# EasyEDA Pro project OSC1.eprj, schematic 编码器
Create Date: 2024-10-08; Page Name: P1; Project Name: OSC; Schematic Name: Schematic2; Update Date: 2024-10-08; Company: 嘉立创EDA; Page Size: A4; Version: V1.0
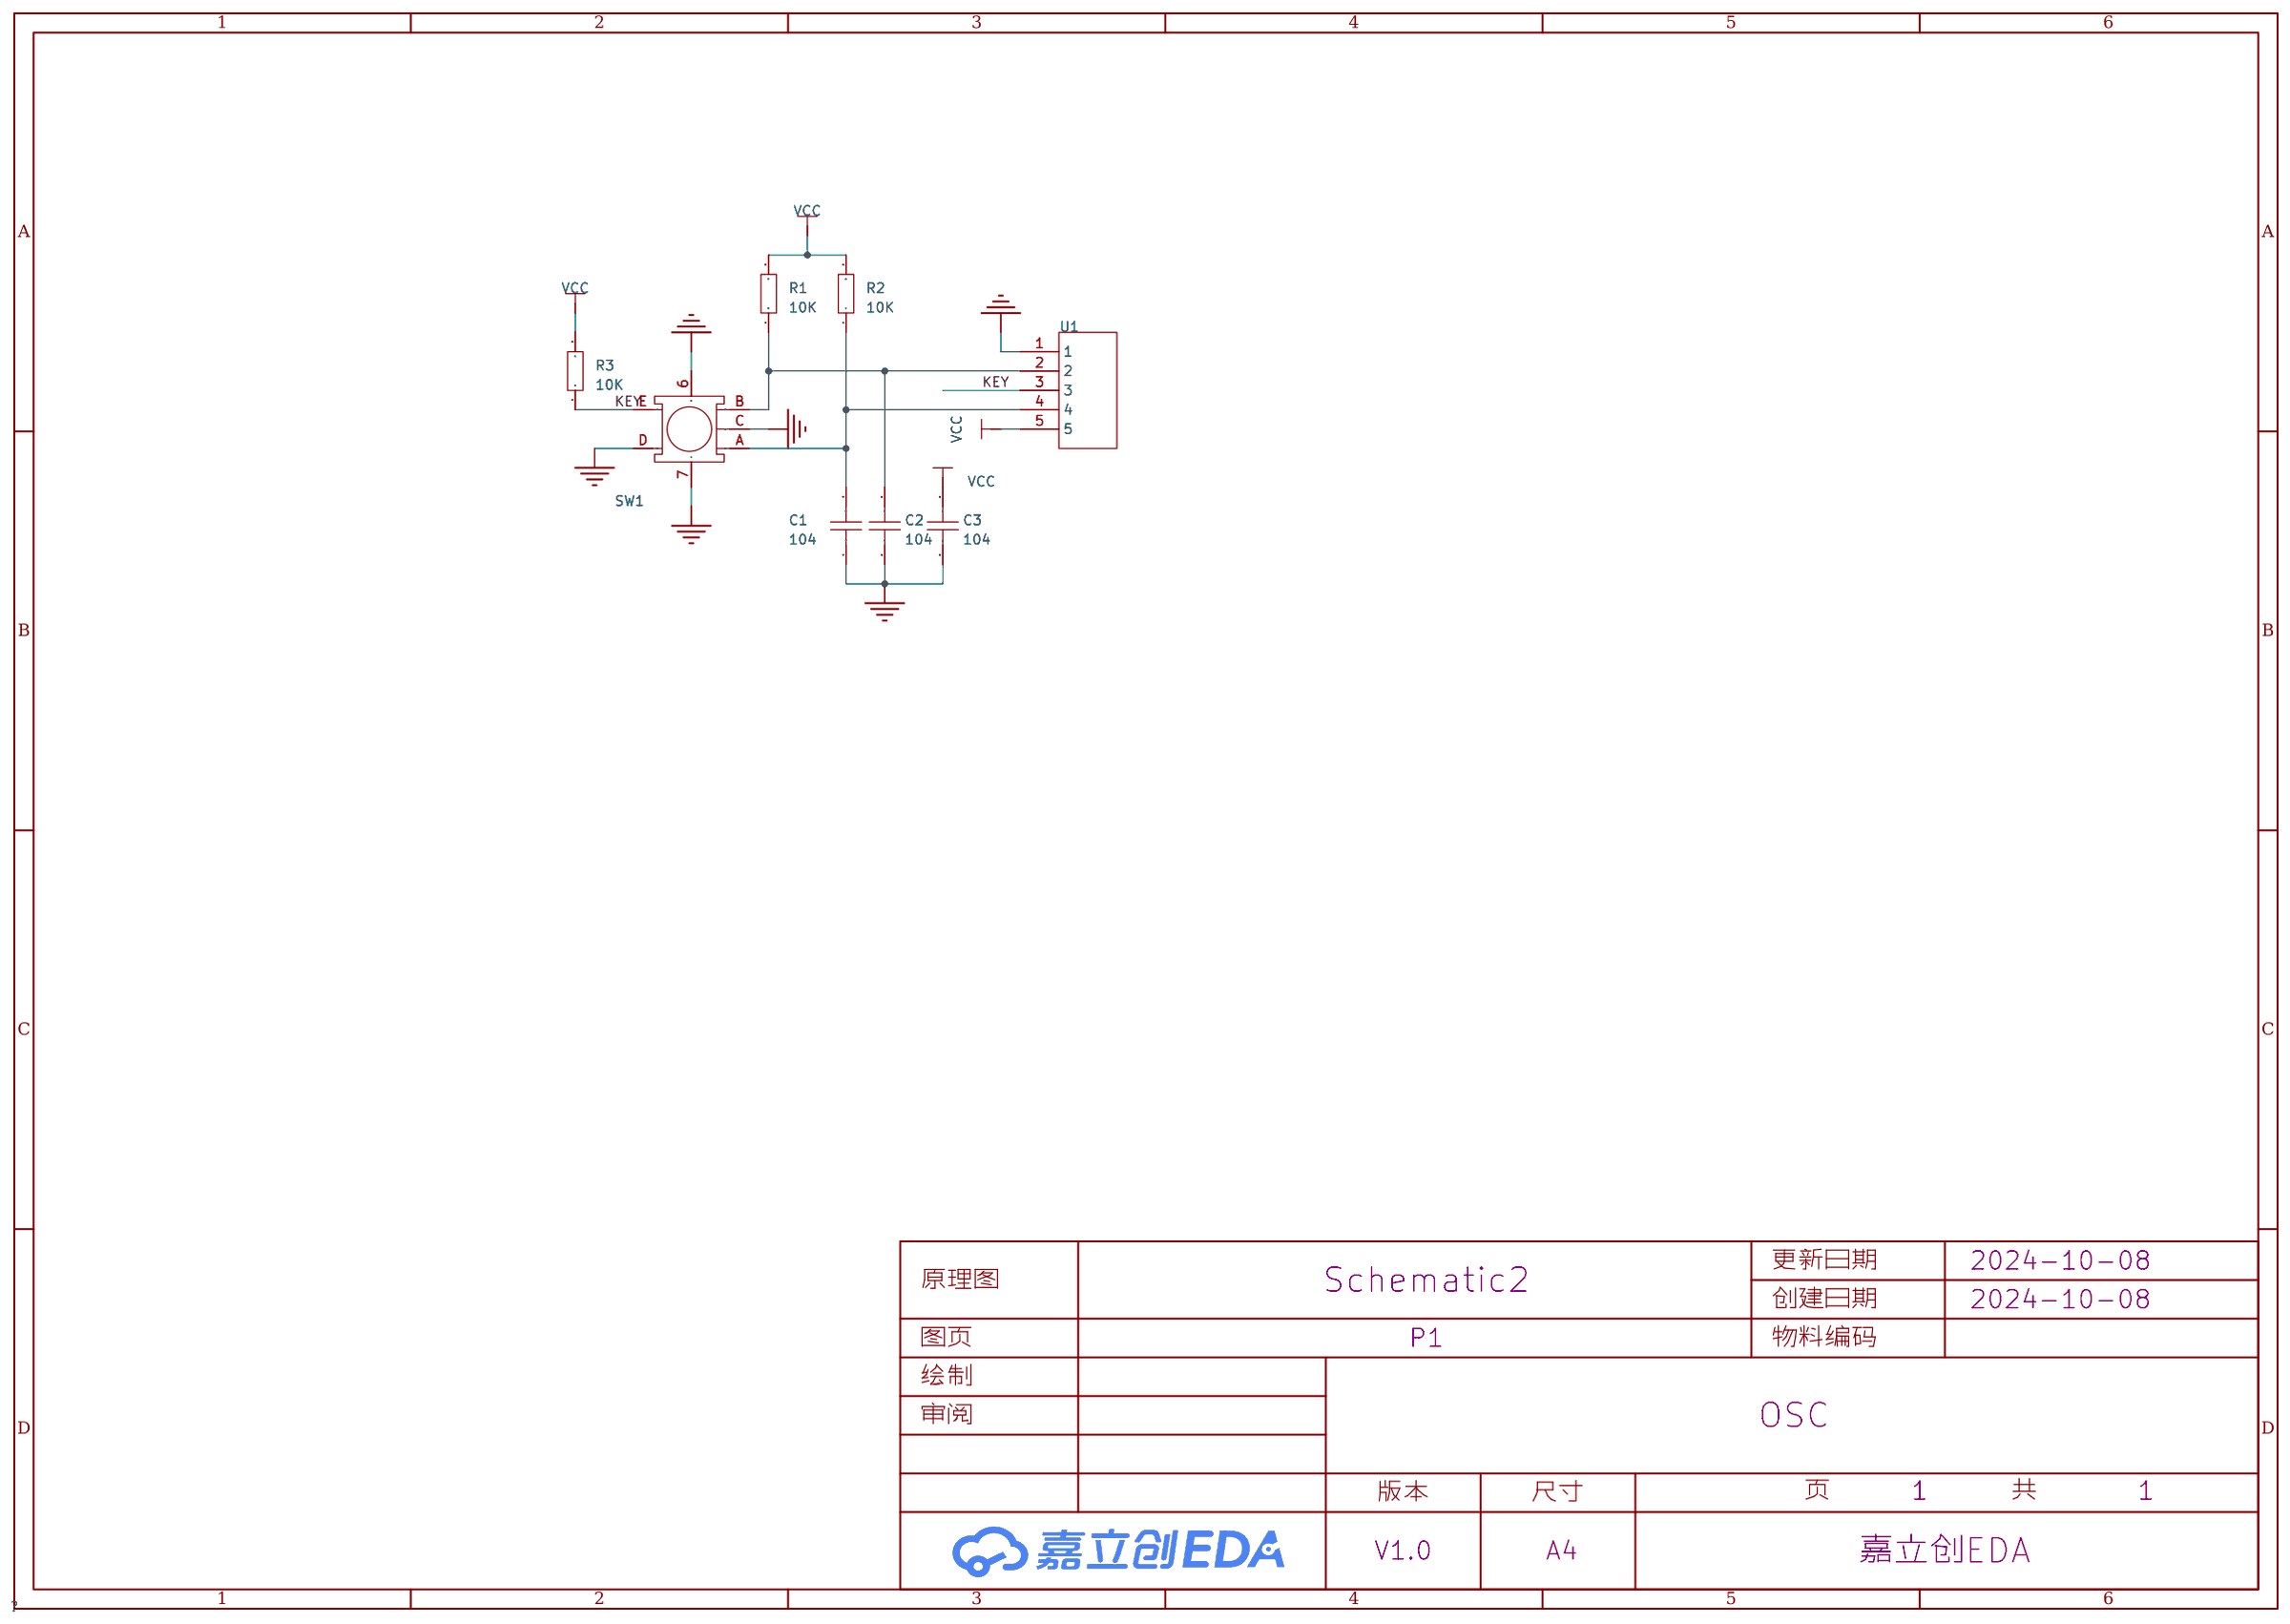
[diagram p7: schematic sheet]

## Parts
C1  104  [280*100mil]
C2  104  [280*100mil]
C3  104  [280*100mil]
R1  10K  [240*80mil]
R2  10K  [240*80mil]
R3  10K  [240*80mil]
SW1  -  [旋转编码器]
U1  -  [CH2.54-5插座]

## Library data of the parts
C1-C3 = 插件电容
R1-R3 = 插件电阻
SW1 = EC11E15244B2: Supplier Footprint: 插件
U1 = HDR-5P

## Nets
GND: C1.1 C2.1 C3.1 SW1.6 SW1.7 SW1.C SW1.D U1.1
VCC: C3.2 R1.2 R2.2 R3.2 U1.5
KEY: R3.1 SW1.E U1.3
$1N521: C1.2 R2.1 SW1.A U1.4
$1N637: C2.2 R1.1 SW1.B U1.2
